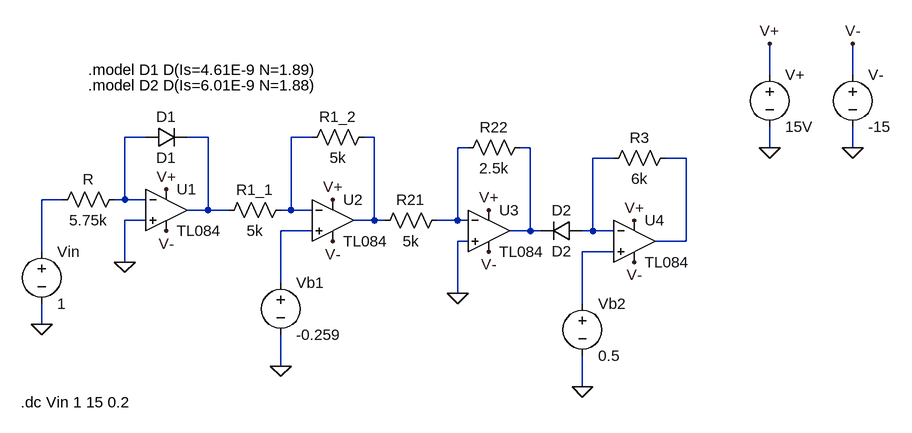
[diagram p0: schematic lAB4.asc]
lAB4.asc, the LTspice schematic file:
Version 4
SHEET 1 1028 680
WIRE 832 -112 832 -160
WIRE 960 -112 960 -160
WIRE -128 -16 -160 -16
WIRE -32 -16 -64 -16
WIRE 128 -16 96 -16
WIRE 224 -16 208 -16
WIRE 368 0 352 0
WIRE 464 0 448 0
WIRE 832 0 832 -32
WIRE 960 0 960 -32
WIRE 592 16 560 16
WIRE 704 16 672 16
WIRE -256 80 -288 80
WIRE -160 80 -160 -16
WIRE -160 80 -176 80
WIRE -128 80 -160 80
WIRE -32 96 -32 -16
WIRE -32 96 -64 96
WIRE 0 96 -32 96
WIRE 96 96 96 -16
WIRE 96 96 80 96
WIRE 128 96 96 96
WIRE -128 112 -160 112
WIRE 224 112 224 -16
WIRE 224 112 192 112
WIRE 240 112 224 112
WIRE 352 112 352 0
WIRE 352 112 320 112
WIRE 368 112 352 112
WIRE 128 128 80 128
WIRE 464 128 464 0
WIRE 464 128 432 128
WIRE 480 128 464 128
WIRE 560 128 560 16
WIRE 560 128 544 128
WIRE 592 128 560 128
WIRE 368 144 352 144
WIRE 704 144 704 16
WIRE 704 144 656 144
WIRE -288 160 -288 80
WIRE 592 160 544 160
WIRE -160 176 -160 112
WIRE 80 208 80 128
WIRE 352 224 352 144
WIRE 544 240 544 160
WIRE -288 272 -288 240
WIRE 80 336 80 288
WIRE 544 368 544 320
FLAG -160 176 0
FLAG 80 336 0
FLAG 352 224 0
FLAG 544 368 0
FLAG -288 272 0
FLAG 832 0 0
FLAG 960 0 0
FLAG 960 -160 V-
FLAG 400 160 V-
FLAG 160 144 V-
FLAG -96 128 V-
FLAG 624 176 V-
FLAG 832 -160 V+
FLAG 400 96 V+
FLAG 160 80 V+
FLAG -96 64 V+
FLAG 624 112 V+
SYMBOL AutoGenerated\\TL084 -96 96 R0
SYMATTR InstName U1
SYMBOL AutoGenerated\\TL084 160 112 R0
SYMATTR InstName U2
SYMBOL AutoGenerated\\TL084 400 128 R0
SYMATTR InstName U3
SYMBOL AutoGenerated\\TL084 624 144 R0
SYMATTR InstName U4
SYMBOL res 336 96 R90
WINDOW 0 0 56 VBottom 2
WINDOW 3 32 56 VTop 2
SYMATTR InstName R21
SYMATTR Value 5k
SYMBOL res 96 80 R90
WINDOW 0 0 56 VBottom 2
WINDOW 3 32 56 VTop 2
SYMATTR InstName R1_1
SYMATTR Value 5k
SYMBOL res 464 -16 R90
WINDOW 0 0 56 VBottom 2
WINDOW 3 32 56 VTop 2
SYMATTR InstName R22
SYMATTR Value 2.5k
SYMBOL res 224 -32 R90
WINDOW 0 0 56 VBottom 2
WINDOW 3 32 56 VTop 2
SYMATTR InstName R1_2
SYMATTR Value 5k
SYMBOL res 688 0 R90
WINDOW 0 0 56 VBottom 2
WINDOW 3 32 56 VTop 2
SYMATTR InstName R3
SYMATTR Value 6k
SYMBOL voltage 80 192 R0
SYMATTR InstName Vb1
SYMATTR Value -0.259
SYMBOL voltage 544 224 R0
SYMATTR InstName Vb2
SYMATTR Value 0.5
SYMBOL diode -128 0 R270
WINDOW 0 32 32 VTop 2
WINDOW 3 0 32 VBottom 2
SYMATTR InstName D1
SYMATTR Value D1
SYMBOL diode 544 112 R90
WINDOW 0 0 32 VBottom 2
WINDOW 3 32 32 VTop 2
SYMATTR InstName D2
SYMATTR Value D2
SYMBOL voltage -288 144 R0
SYMATTR InstName Vin
SYMATTR Value 1
SYMBOL res -160 64 R90
WINDOW 0 0 56 VBottom 2
WINDOW 3 32 56 VTop 2
SYMATTR InstName R
SYMATTR Value 5.75k
SYMBOL voltage 832 -128 R0
SYMATTR InstName V+
SYMATTR Value 15V
SYMBOL voltage 960 -128 R0
WINDOW 123 0 0 Left 0
WINDOW 39 0 0 Left 0
SYMATTR InstName V-
SYMATTR Value -15
TEXT -216 -120 Left 2 !.model D1 D(Is=4.61E-9 N=1.89)
TEXT -216 -96 Left 2 !.model D2 D(Is=6.01E-9 N=1.88)
TEXT -320 392 Left 2 !.dc Vin 1 15 0.2

The netlist it stands for:
* lAB4.asc
* U1: TL084 (symbol AutoGenerated\TL084 not available, pins judged from their places): In+=0 In-=N001 V+=V+ V-=V- OUT=N002
* U2: TL084 (symbol AutoGenerated\TL084 not available, pins judged from their places): In+=N010 In-=N003 V+=V+ V-=V- OUT=N004
* U3: TL084 (symbol AutoGenerated\TL084 not available, pins judged from their places): In+=0 In-=N005 V+=V+ V-=V- OUT=N006
* U4: TL084 (symbol AutoGenerated\TL084 not available, pins judged from their places): In+=N011 In-=N007 V+=V+ V-=V- OUT=N008
R21 N005 N004 5k
R1_1 N003 N002 5k
R22 N006 N005 2.5k
R1_2 N004 N003 5k
R3 N008 N007 6k
Vb1 N010 0 -0.259
Vb2 N011 0 0.5
D1 N001 N002 D1
D2 N007 N006 D2
Vin N009 0 1
R N001 N009 5.75k
V+ V+ 0 15V
V- V- 0 -15
.model D D
.lib standard.dio
.model D1 D(Is=4.61E-9 N=1.89)
.model D2 D(Is=6.01E-9 N=1.88)
.dc Vin 1 15 0.2
.backanno
.end